# Altium schematic sheet [11] - CPU - POWER.SchDoc
size A2; DocumentNumber: 11; SheetNumber: 11; SheetTotal: 20
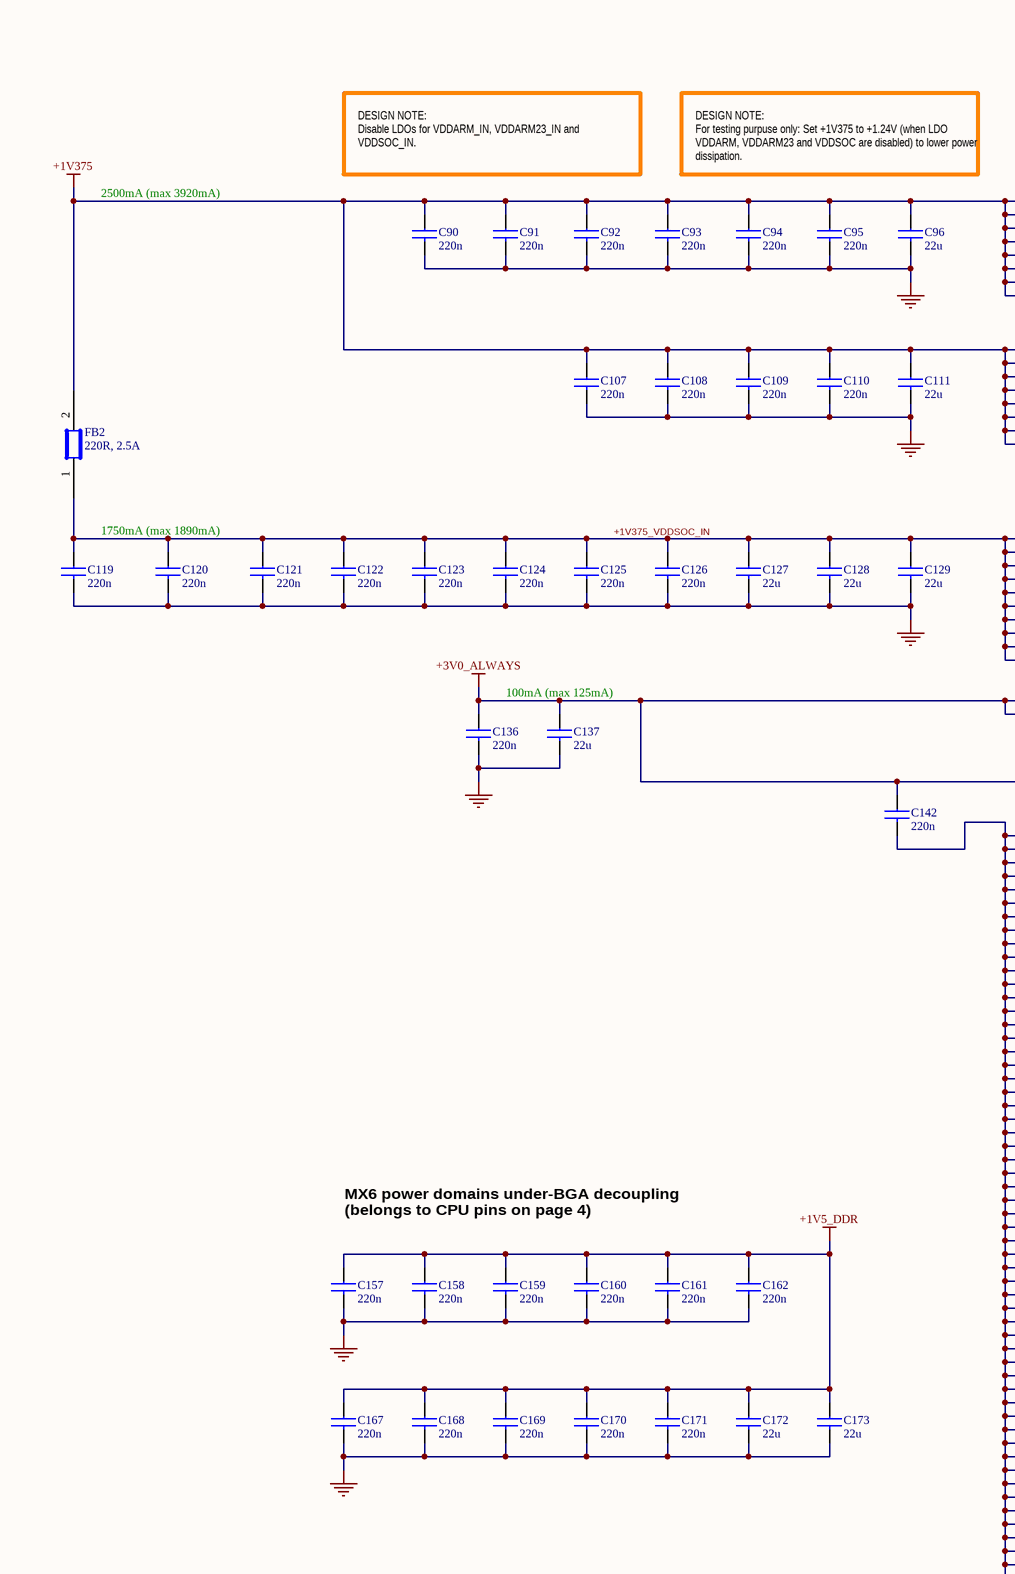
[diagram p0: [11] - CPU - POWER.SchDoc, left]
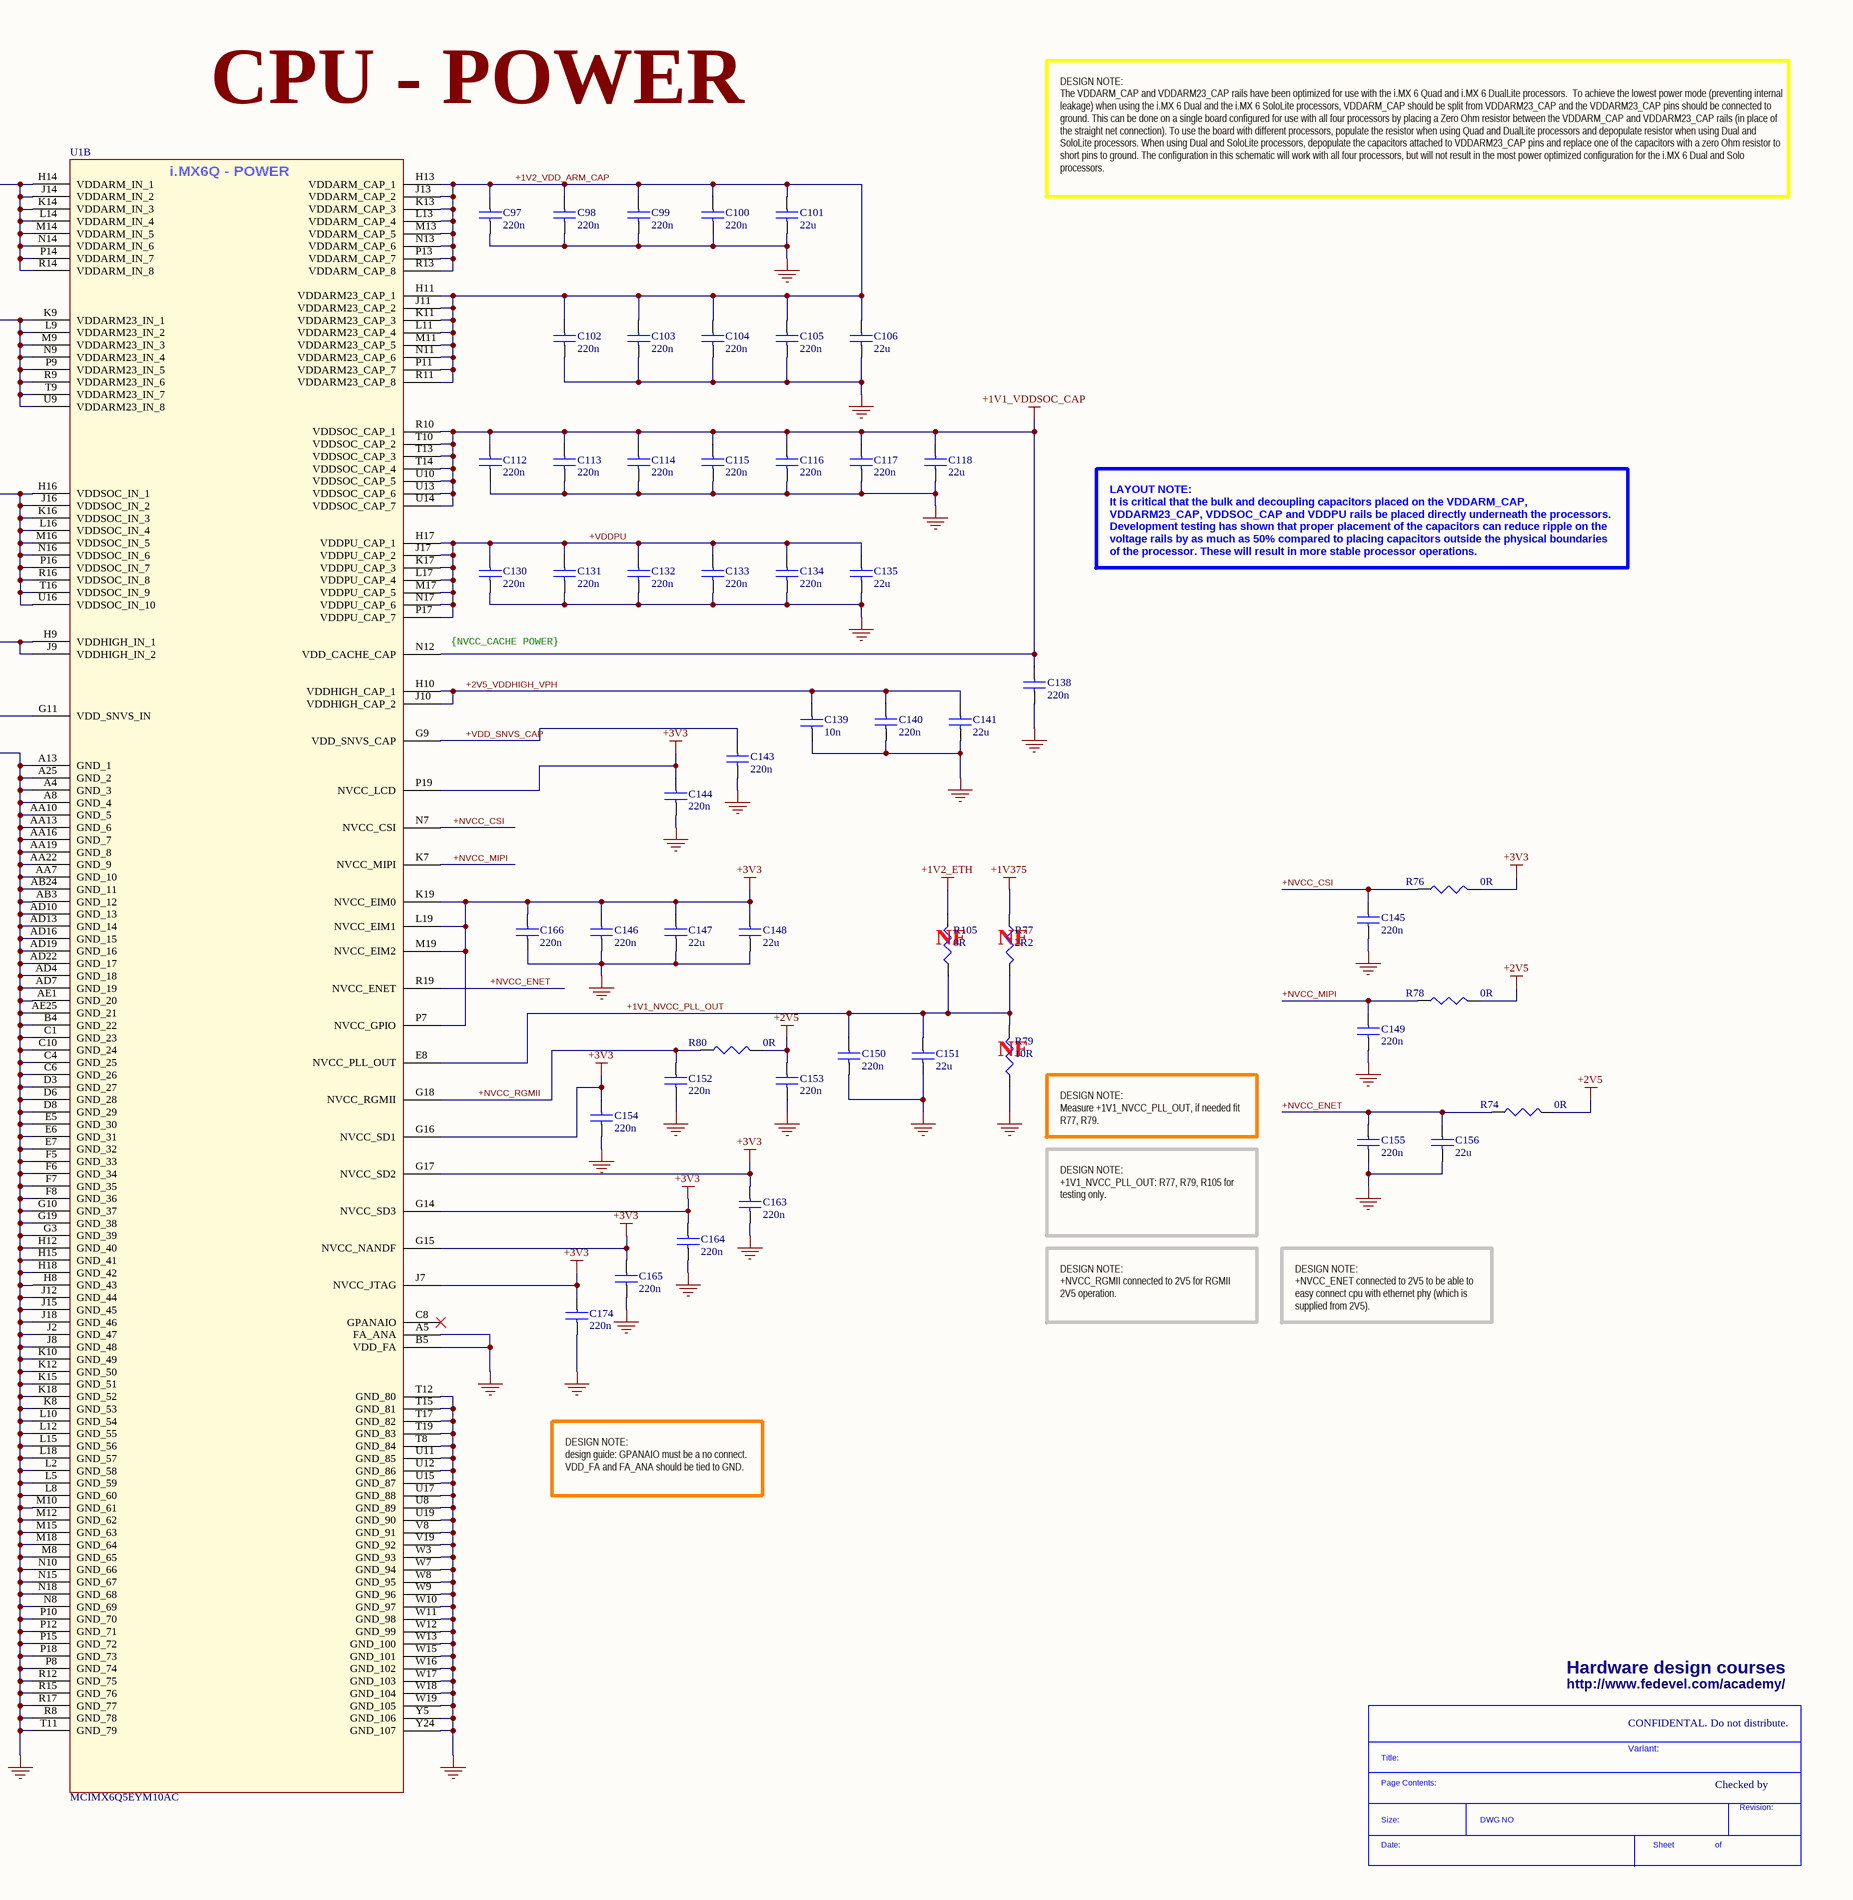
[diagram p1: [11] - CPU - POWER.SchDoc, right]

## Parts
*  SDTitleBlock  (value not drawn)  (graphical)
C90  220n  [C0402]
C91  220n  [C0402]
C92  220n  [C0402]
C93  220n  [C0402]
C94  220n  [C0402]
C95  220n  [C0402]
C96  22u  [C0603]
C97  220n  [C0402]
C98  220n  [C0402]
C99  220n  [C0402]
C100  220n  [C0402]
C101  22u  [C0603]
C102  220n  [C0402]
C103  220n  [C0402]
C104  220n  [C0402]
C105  220n  [C0402]
C106  22u  [C0603]
C107  220n  [C0402]
C108  220n  [C0402]
C109  220n  [C0402]
C110  220n  [C0402]
C111  22u  [C0603]
C112  220n  [C0402]
C113  220n  [C0402]
C114  220n  [C0402]
C115  220n  [C0402]
C116  220n  [C0402]
C117  220n  [C0402]
C118  22u  [C0603]
C119  220n  [C0402]
C120  220n  [C0402]
C121  220n  [C0402]
C122  220n  [C0402]
C123  220n  [C0402]
C124  220n  [C0402]
C125  220n  [C0402]
C126  220n  [C0402]
C127  22u  [C0603]
C128  22u  [C0603]
C129  22u  [C0603]
C130  220n  [C0402]
C131  220n  [C0402]
C132  220n  [C0402]
C133  220n  [C0402]
C134  220n  [C0402]
C135  22u  [C0603]
C136  220n  [C0402]
C137  22u  [C0805]
C138  220n  [C0402]
C139  10n  [C0402]
C140  220n  [C0402]
C141  22u  [C0805]
C142  220n  [C0402]
C143  220n  [C0402]
C144  220n  [C0402]
C145  220n  [C0402]
C146  220n  [C0402]
C147  22u  [C0805]
C148  22u  [C0805]
C149  220n  [C0402]
C150  220n  [C0402]
C151  22u  [C0603]
C152  220n  [C0402]
C153  220n  [C0402]
C154  220n  [C0402]
C155  220n  [C0402]
C156  22u  [C0805]
C157  220n  [C0402]
C158  220n  [C0402]
C159  220n  [C0402]
C160  220n  [C0402]
C161  220n  [C0402]
C162  220n  [C0402]
C163  220n  [C0402]
C164  220n  [C0402]
C165  220n  [C0402]
C166  220n  [C0402]
C167  220n  [C0402]
C168  220n  [C0402]
C169  220n  [C0402]
C170  220n  [C0402]
C171  220n  [C0402]
C172  22u  [C0603]
C173  22u  [C0603]
C174  220n  [C0402]
FB2  220R, 2.5A  [C0603]
R74  0R  [R0402]
R76  0R  [R0402]
R77  2R2  [R0402]
R78  0R  [R0402]
R79  10R  [R0402]
R80  0R  [R0402]
R105  0R  [R0402]
U1  MCIMX6Q5EYM10AC  [PBGA624]  (part B of 15)

## Nets
+1V1_VDDSOC_CAP: C112.1 C113.1 C114.1 C115.1 C116.1 C117.1 C118.1 C138.1 U1.N12(VDD_CACHE_CAP) U1.R10(VDDSOC_CAP_1) U1.T10(VDDSOC_CAP_2) U1.T13(VDDSOC_CAP_3) U1.T14(VDDSOC_CAP_4) U1.U10(VDDSOC_CAP_5) U1.U13(VDDSOC_CAP_6) U1.U14(VDDSOC_CAP_7)
+1V2_ETH: R105.2
+1V5_DDR: C157.1 C158.1 C159.1 C160.1 C161.1 C162.1 C167.1 C168.1 C169.1 C170.1 C171.1 C172.1 C173.1
+1V375: C90.1 C91.1 C92.1 C93.1 C94.1 C95.1 C96.1 C107.1 C108.1 C109.1 C110.1 C111.1 FB2.2 R77.1 U1.H14(VDDARM_IN_1) U1.J14(VDDARM_IN_2) U1.K9(VDDARM23_IN_1) U1.K14(VDDARM_IN_3) U1.L9(VDDARM23_IN_2) U1.L14(VDDARM_IN_4) U1.M9(VDDARM23_IN_3) U1.M14(VDDARM_IN_5) U1.N9(VDDARM23_IN_4) U1.N14(VDDARM_IN_6) U1.P9(VDDARM23_IN_5) U1.P14(VDDARM_IN_7) U1.R9(VDDARM23_IN_6) U1.R14(VDDARM_IN_8) U1.T9(VDDARM23_IN_7) U1.U9(VDDARM23_IN_8)
+2V5: C153.1 R74.2 R78.2 R80.2
+3V0_ALWAYS: C136.1 C137.1 C142.1 U1.G11(VDD_SNVS_IN) U1.H9(VDDHIGH_IN_1) U1.J9(VDDHIGH_IN_2)
+3V3: C144.1 C146.1 C147.1 C148.1 C154.1 C163.1 C164.1 C165.1 C166.1 C174.1 R76.2 U1.G14(NVCC_SD3) U1.G15(NVCC_NANDF) U1.G16(NVCC_SD1) U1.G17(NVCC_SD2) U1.J7(NVCC_JTAG) U1.K19(NVCC_EIM0) U1.L19(NVCC_EIM1) U1.M19(NVCC_EIM2) U1.P7(NVCC_GPIO) U1.P19(NVCC_LCD)
GND: C90.2 C91.2 C92.2 C93.2 C94.2 C95.2 C96.2 C97.2 C98.2 C99.2 C100.2 C101.2 C102.2 C103.2 C104.2 C105.2 C106.2 C107.2 C108.2 C109.2 C110.2 C111.2 C112.2 C113.2 C114.2 C115.2 C116.2 C117.2 C118.2 C119.2 C120.2 C121.2 C122.2 C123.2 C124.2 C125.2 C126.2 C127.2 C128.2 C129.2 C130.2 C131.2 C132.2 C133.2 C134.2 C135.2 C136.2 C137.2 C138.2 C139.1 C140.2 C141.2 C142.2 C143.2 C144.2 C145.2 C146.2 C147.2 C148.2 C149.2 C150.2 C151.2 C152.2 C153.2 C154.2 C155.2 C156.2 C157.2 C158.2 C159.2 C160.2 C161.2 C162.2 C163.2 C164.2 C165.2 C166.2 C167.2 C168.2 C169.2 C170.2 C171.2 C172.2 C173.2 C174.2 R79.1 U1.A4(GND_3) U1.A5(FA_ANA) U1.A8(GND_4) U1.A13(GND_1) U1.A25(GND_2) U1.AA7(GND_10) U1.AA10(GND_5) U1.AA13(GND_6) U1.AA16(GND_7) U1.AA19(GND_8) U1.AA22(GND_9) U1.AB3(GND_12) U1.AB24(GND_11) U1.AD4(GND_18) U1.AD7(GND_19) U1.AD10(GND_13) U1.AD13(GND_14) U1.AD16(GND_15) U1.AD19(GND_16) U1.AD22(GND_17) U1.AE1(GND_20) U1.AE25(GND_21) U1.B4(GND_22) U1.B5(VDD_FA) U1.C1(GND_23) U1.C4(GND_25) U1.C6(GND_26) U1.C10(GND_24) U1.D3(GND_27) U1.D6(GND_28) U1.D8(GND_29) U1.E5(GND_30) U1.E6(GND_31) U1.E7(GND_32) U1.F5(GND_33) U1.F6(GND_34) U1.F7(GND_35) U1.F8(GND_36) U1.G3(GND_39) U1.G10(GND_37) U1.G19(GND_38) U1.H8(GND_43) U1.H12(GND_40) U1.H15(GND_41) U1.H18(GND_42) U1.J2(GND_47) U1.J8(GND_48) U1.J12(GND_44) U1.J15(GND_45) U1.J18(GND_46) U1.K8(GND_53) U1.K10(GND_49) U1.K12(GND_50) U1.K15(GND_51) U1.K18(GND_52) U1.L2(GND_58) U1.L5(GND_59) U1.L8(GND_60) U1.L10(GND_54) U1.L12(GND_55) U1.L15(GND_56) U1.L18(GND_57) U1.M8(GND_65) U1.M10(GND_61) U1.M12(GND_62) U1.M15(GND_63) U1.M18(GND_64) U1.N8(GND_69) U1.N10(GND_66) U1.N15(GND_67) U1.N18(GND_68) U1.P8(GND_74) U1.P10(GND_70) U1.P12(GND_71) U1.P15(GND_72) U1.P18(GND_73) U1.R8(GND_78) U1.R12(GND_75) U1.R15(GND_76) U1.R17(GND_77) U1.T8(GND_84) U1.T11(GND_79) U1.T12(GND_80) U1.T15(GND_81) U1.T17(GND_82) U1.T19(GND_83) U1.U8(GND_89) U1.U11(GND_85) U1.U12(GND_86) U1.U15(GND_87) U1.U17(GND_88) U1.U19(GND_90) U1.V8(GND_91) U1.V19(GND_92) U1.W3(GND_93) U1.W7(GND_94) U1.W8(GND_95) U1.W9(GND_96) U1.W10(GND_97) U1.W11(GND_98) U1.W12(GND_99) U1.W13(GND_100) U1.W15(GND_101) U1.W16(GND_102) U1.W17(GND_103) U1.W18(GND_104) U1.W19(GND_105) U1.Y5(GND_106) U1.Y24(GND_107)
+1V1_NVCC_PLL_OUT: C150.1 C151.1 R77.2 R79.2 R105.1 U1.E8(NVCC_PLL_OUT)
+1V2_VDD_ARM_CAP: C97.1 C98.1 C99.1 C100.1 C101.1 C102.1 C103.1 C104.1 C105.1 C106.1 U1.H11(VDDARM23_CAP_1) U1.H13(VDDARM_CAP_1) U1.J11(VDDARM23_CAP_2) U1.J13(VDDARM_CAP_2) U1.K11(VDDARM23_CAP_3) U1.K13(VDDARM_CAP_3) U1.L11(VDDARM23_CAP_4) U1.L13(VDDARM_CAP_4) U1.M11(VDDARM23_CAP_5) U1.M13(VDDARM_CAP_5) U1.N11(VDDARM23_CAP_6) U1.N13(VDDARM_CAP_6) U1.P11(VDDARM23_CAP_7) U1.P13(VDDARM_CAP_7) U1.R11(VDDARM23_CAP_8) U1.R13(VDDARM_CAP_8)
+1V375_VDDSOC_IN: C119.1 C120.1 C121.1 C122.1 C123.1 C124.1 C125.1 C126.1 C127.1 C128.1 C129.1 FB2.1 U1.H16(VDDSOC_IN_1) U1.J16(VDDSOC_IN_2) U1.K16(VDDSOC_IN_3) U1.L16(VDDSOC_IN_4) U1.M16(VDDSOC_IN_5) U1.N16(VDDSOC_IN_6) U1.P16(VDDSOC_IN_7) U1.R16(VDDSOC_IN_8) U1.T16(VDDSOC_IN_9) U1.U16(VDDSOC_IN_10)
+2V5_VDDHIGH_VPH: C139.2 C140.1 C141.1 U1.H10(VDDHIGH_CAP_1) U1.J10(VDDHIGH_CAP_2)
+NVCC_CSI: C145.1 R76.1 U1.N7(NVCC_CSI)
+NVCC_ENET: C155.1 C156.1 R74.1 U1.R19(NVCC_ENET)
+NVCC_MIPI: C149.1 R78.1 U1.K7(NVCC_MIPI)
+NVCC_RGMII: C152.1 R80.1 U1.G18(NVCC_RGMII)
+VDD_SNVS_CAP: C143.1 U1.G9(VDD_SNVS_CAP)
+VDDPU: C130.1 C131.1 C132.1 C133.1 C134.1 C135.1 U1.H17(VDDPU_CAP_1) U1.J17(VDDPU_CAP_2) U1.K17(VDDPU_CAP_3) U1.L17(VDDPU_CAP_4) U1.M17(VDDPU_CAP_5) U1.N17(VDDPU_CAP_6) U1.P17(VDDPU_CAP_7)

Not connected (* = marked no-connect by the designer): U1 C8(GPANAIO)*

## Notes on the sheet
- CPU - POWER
- 2500mA (max 3920mA)
- DESIGN NOTE:
  Disable LDOs for VDDARM_IN, VDDARM23_IN and VDDSOC_IN.
- DESIGN NOTE:
  For testing purpuse only: Set +1V375 to +1.24V (when LDO VDDARM, VDDARM23 and VDDSOC are disabled) to lower power dissipation.
- DESIGN NOTE:
  The VDDARM_CAP and VDDARM23_CAP rails have been optimized for use with the i.MX 6 Quad and i.MX 6 DualLite processors.  To achieve the lowest power mode (preventing internal leakage) when using the i.MX 6 Dual and the i.MX 6 SoloLite processors, VDDARM_CAP should be split from VDDARM23_CAP and the VDDARM23_CAP pins should be connected to ground. This can be done on a single board configured for use with all four processors by placing a Zero Ohm resistor between the VDDARM_CAP and VDDARM23_CAP rails (in place of the straight net connection). To use the board with different processors, populate the resistor when using Quad and DualLite processors and depopulate resistor when using Dual and SoloLite processors. When using Dual and SoloLite processors, depopulate the capacitors attached to VDDARM23_CAP pins and replace one of the capacitors with a zero Ohm resistor to short pins to ground. The configuration in this schematic will work with all four processors, but will not result in the most power optimized configuration for the i.MX 6 Dual and Solo processors.
- 1750mA (max 1890mA)
- LAYOUT NOTE:
  It is critical that the bulk and decoupling capacitors placed on the VDDARM_CAP, VDDARM23_CAP, VDDSOC_CAP and VDDPU rails be placed directly underneath the processors. Development testing has shown that proper placement of the capacitors can reduce ripple on the voltage rails by as much as 50% compared to placing capacitors outside the physical boundaries of the processor. These will result in more stable processor operations.
- 100mA (max 125mA)
- {NVCC_CACHE POWER}
- (near R105) NF
- (near R77) NF
- (near R79) NF
- MX6 power domains under-BGA decoupling (belongs to CPU pins on page 4)
- DESIGN NOTE:
  Measure +1V1_NVCC_PLL_OUT, if needed fit R77, R79.
- DESIGN NOTE:
  +1V1_NVCC_PLL_OUT: R77, R79, R105 for testing only.
- DESIGN NOTE:
  +NVCC_RGMII connected to 2V5 for RGMII 2V5 operation.
- DESIGN NOTE:
  +NVCC_ENET connected to 2V5 to be able to easy connect cpu with ethernet phy (which is supplied from 2V5).
- DESIGN NOTE:
  design guide: GPANAIO must be a no connect. VDD_FA and FA_ANA should be tied to GND.
- Hardware design courses
- http://www.fedevel.com/academy/
- CONFIDENTAL. Do not distribute.
- Variant:
- Checked by
- (in symbol MCIMX6Q5EYM10AC, part B) i.MX6Q - POWER
- (in symbol SDTitleBlock) Title:; Page Contents:; Revision:; Size:; DWG NO; Date:; Sheet; of

## Library data of the parts
C90-C95 C97-C100 C102-C105 C107-C110 C112-C117 C119-C126 C130-C134 C136 C138 C140 C142-C146 C149 C150 C152-C155 C157-C171 C174 = C1005X5R1E224M: CAP CER .22UF 25V X5R 20% 0402; Manufacturer: TDK Corporation; Capacitance: 0.22µF; Value: 220nF; .Checked PCB: used; Description: CAP CER 0.22UF 25V 20% X5R 0402; Category: Capacitors; Supplier Part Number: 445-5945-1-ND; Manufacturer Part Number: C1005X5R1E224M; Operating Temperature: -55°C ~ 85°C; Package / Case: 0402 (1005 Metric); Price 1k [$]: 0.02600; .Checked SCH: used; Voltage - Rated: 25V; Supplier: Digikey; Supplier 1: Digi-Key; Supplier Part Number 1: 445-5945-1-ND; RoHS: RoHS Compliant; Stock 1: 54593; Pricing 1: 1=0.3, 10=0.2, 100=0.08, 250=0.05752, 500=0.041, 1000=0.03 (USD); Tolerance: ±20%; Temperature Coefficient: X5R; Mounting Type: Surface Mount, MLCC; Applications: General Purpose; Ratings: -; Size / Dimension: 0.039" L x 0.020" W (1.00mm x 0.50mm); Height - Seated (Max): -; Thickness (Max): 0.022" (0.55mm); Lead Spacing: -; Features: -; Packaging: Cut Tape (CT); Lead Style: -; ComponentLink1URL: http://www.tdk.co.jp/tefe02/e412_c.pdf; ComponentLink1Description: http://www.tdk.co.jp/tefe02/e412_c.pdf
C96 C101 C106 C111 C118 C127-C129 C135 C151 C172 C173 = GRM188R60G226MEA0L: CAP CER 22UF 4V 20% X5R 0603; Manufacturer: Murata Electronics North America; Capacitance: 22µF; .Checked PCB: RF, used by MM; .Checked SCH: MM, checked by RF; .Creator: MM; Supplier 1: Digi-Key; Supplier Part Number 1: 490-5526-1-ND; Manufacturer Part Number: GRM188R60G226MEA0L; RoHS: RoHS Compliant; Category: Capacitors; Stock 1: 5760; Pricing 1: 1=0.79, 10=0.663, 50=0.4752, 100=0.4158, 250=0.32672, 500=0.297, 1000=0.2376 (USD); Voltage - Rated: 4V; Tolerance: ±20%; Temperature Coefficient: X5R; Mounting Type: Surface Mount, MLCC; Operating Temperature: -55°C ~ 85°C; Applications: General Purpose; Ratings: -; Package / Case: 0603 (1608 Metric); Size / Dimension: 0.063" L x 0.031" W (1.60mm x 0.80mm); Height - Seated (Max): -; Thickness (Max): 0.035" (0.90mm); Lead Spacing: -; Features: -; Packaging: Cut Tape (CT); Lead Style: -; ComponentLink1URL: http://www.murata.com/products/catalog/pdf/c02e.pdf; ComponentLink1Description: http://www.murata.com/products/catalog/pdf/c02e.pdf
C137 C141 C147 C148 C156 = C2012X5R1C226K: CAP CER 22UF 16V 10% X5R 0805; Manufacturer: TDK Corporation; Capacitance: 22µF; .Checked PCB: RF; Supplier 1: Digi-Key; Supplier Part Number 1: 445-6797-1-ND; Manufacturer Part Number: C2012X5R1C226K; RoHS: RoHS Compliant; Category: Capacitors; Stock 1: 15408; Pricing 1: 1=0.77, 10=0.737, 100=0.3575, 250=0.297, 500=0.2695, 1000=0.2475 (USD); Voltage - Rated: 16V; Tolerance: ±10%; Temperature Coefficient: X5R; Mounting Type: Surface Mount, MLCC; Operating Temperature: -55°C ~ 85°C; Applications: General Purpose; Ratings: -; Package / Case: 0805 (2012 Metric); Size / Dimension: 0.079" L x 0.049" W (2.00mm x 1.25mm); Height - Seated (Max): -; Thickness (Max): 0.057" (1.45mm); Lead Spacing: -; Features: -; Packaging: Cut Tape (CT); Lead Style: -; ComponentLink1URL: http://www.tdk.com/pdf/general_B11.pdf; ComponentLink1Description: http://www.tdk.com/pdf/general_B11.pdf; .Checked SCH: RF
C139 = C1005X7R1H103K: CAP CER 10000PF 50V 10% X7R 0402; Manufacturer: TDK Corporation; Value: 10nF; .Checked PCB: RF; Capacitance: 10000pF; Category: Capacitors; Supplier Part Number: 445-6850-1-ND; Manufacturer Part Number: C1005X7R1H103K; Operating Temperature: -55°C ~ 125°C; Package / Case: 0402 (1005 Metric); Price 1k [$]: 0.01625; .Checked SCH: RF; Voltage - Rated: 50V; Supplier: Digikey; Supplier 1: Digi-Key; Supplier Part Number 1: 445-6850-1-ND; RoHS: RoHS Compliant; Stock 1: 3901; Pricing 1: 1=0.2, 10=0.125, 100=0.045, 250=0.03252, 500=0.024, 1000=0.01625 (USD); Tolerance: ±10%; Temperature Coefficient: X7R; Mounting Type: Surface Mount, MLCC; Applications: General Purpose; Ratings: -; Size / Dimension: 0.039" L x 0.020" W (1.00mm x 0.50mm); Height - Seated (Max): -; Thickness (Max): 0.022" (0.55mm); Lead Spacing: -; Features: -; Packaging: Cut Tape (CT); Lead Style: -; ComponentLink1URL: http://www.tdk.co.jp/tefe02/e412_c.pdf; ComponentLink1Description: http://www.tdk.co.jp/tefe02/e412_c.pdf
FB2 = BLM18SG221TN1D: FERRITE CHIP 220 OHM 2500MA 0603; Manufacturer: Murata Electronics North America; Impedance @ Frequency: 220 Ohm @ 100MHz; DC Resistance (DCR): 40 mOhm Max; Filter Type: Differential Mode - Single; Number of Lines: 1; .Checked PCB: RF; Supplier 1: Digi-Key; Supplier Part Number 1: 490-5225-1-ND; Manufacturer Part Number: BLM18SG221TN1D; RoHS: RoHS Compliant; Category: Filters; Stock 1: 54640; Pricing 1: 1=0.38, 10=0.282, 50=0.1646, 100=0.1316, 250=0.094, 500=0.06392, 1000=0.0517, 5000=0.04042 (USD); Current Rating: 2.5A; Package / Case: 0603 (1608 Metric); Mounting Type: Surface Mount; Packaging: Cut Tape (CT); Height (Max): 0.037" (0.95mm); Size / Dimension: 0.063" L x 0.031" W (1.60mm x 0.80mm); ComponentLink1URL: http://search.murata.co.jp/Ceramy/image/img/PDF/ENG/L0110S0100BLM18S.pdf; ComponentLink1Description: http://search.murata.co.jp/Ceramy/image/img/PDF/ENG/L0110S0100BLM18S.pdf; .Checked SCH: RF
R74 R76 R78 R80 R105 = RC0402JR-070RL: RES 0.0 OHM 1/16W 0402 SMD; Manufacturer: Yageo; Resistance (Ohms): 0.0; Power (Watts): 0.063W, 1/16W; Tolerance: Jumper; .Checked PCB: used; Category: Resistors; Supplier Part Number: 311-0.0JRCT-ND; Manufacturer Part Number: RC0402JR-070RL; Package / Case: 0402 (1005 Metric); Price 1k [$]: 0.01389; Value: 0R; .Checked SCH: used; Supplier: Digikey; Supplier 1: Digi-Key; Supplier Part Number 1: 311-0.0JRCT-ND; RoHS: RoHS Compliant; Stock 1: 1106330; Pricing 1: 10=0.012, 50=0.009, 100=0.0069, 250=0.00512, 500=0.0038, 1000=0.00253 (USD); Composition: Thick Film; Features: -; Temperature Coefficient: -; Size / Dimension: 0.039" L x 0.020" W (1.00mm x 0.50mm); Height: 0.016" (0.40mm); Number of Terminations: 2; Packaging: Cut Tape (CT); ComponentLink1URL: http://www.yageo.com/documents/recent/PYu-RC0402_51_RoHS_L_6.pdf; ComponentLink1Description: http://www.yageo.com/documents/recent/PYu-RC0402_51_RoHS_L_6.pdf
R77 = CRCW04022R20FKED: RES 2.20 OHM 1/16W 1% 0402 SMD; Manufacturer: Vishay Dale; Resistance (Ohms): 2.2; Power (Watts): 0.063W, 1/16W; Temperature Coefficient: ±100ppm/°C; .Checked PCB: RF; Supplier 1: Digi-Key; Supplier Part Number 1: 541-2.20LLCT-ND; Manufacturer Part Number: CRCW04022R20FKED; RoHS: RoHS Compliant; Category: Resistors; Stock 1: 10205; Pricing 1: 10=0.083, 50=0.0444, 200=0.0255, 1000=0.0174 (USD); Composition: Thick Film; Features: -; Tolerance: ±1%; Package / Case: 0402 (1005 Metric); Size / Dimension: 0.039" L x 0.020" W (1.00mm x 0.50mm); Height: 0.016" (0.40mm); Number of Terminations: 2; Packaging: Cut Tape (CT); ComponentLink1URL: http://www.vishay.com/docs/20035/dcrcwe3.pdf; ComponentLink1Description: http://www.vishay.com/docs/20035/dcrcwe3.pdf; .Checked SCH: RF
R79 = RC0402FR-0710RL: RES 10.0 OHM 1/16W 1% 0402 SMD; Manufacturer: Yageo; Resistance (Ohms): 10; Power (Watts): 0.063W, 1/16W; .Checked PCB: used; Temperature Coefficient: ±200ppm/°C; Category: Resistors; Supplier Part Number: 311-10.0LRCT-ND; Manufacturer Part Number: RC0402FR-0710RL; Package / Case: 0402 (1005 Metric); Price 1k [$]: 0.01421; Tolerance: ±1%; Value: 10R; .Checked SCH: used; Supplier: Digikey; Supplier 1: Digi-Key; Supplier Part Number 1: 311-10.0LRCT-ND; RoHS: RoHS Compliant; Stock 1: 681416; Pricing 1: 10=0.014, 50=0.0104, 100=0.0079, 250=0.00584, 500=0.00432, 1000=0.00288 (USD); Composition: Thick Film; Features: -; Size / Dimension: 0.039" L x 0.020" W (1.00mm x 0.50mm); Height: 0.016" (0.40mm); Number of Terminations: 2; Packaging: Cut Tape (CT); ComponentLink1URL: http://www.yageo.com/documents/recent/PYu-RC0402_51_RoHS_L_6.pdf; ComponentLink1Description: http://www.yageo.com/documents/recent/PYu-RC0402_51_RoHS_L_6.pdf
U1 = MCIMX6Q5EYM10AC: IC MCU 32BIT ARM QUAD 624FCBGA; Manufacturer: Freescale Semiconductor; Core Processor: ARM® Cortex™-A9; Core Size: 32-Bit Quad-Core; Speed: 1.0GHz; Connectivity: CAN, EBI/EMI, ESAI, Ethernet, GPMI, I2C, MMC/SD, PCI, SATA, SPI, UART, USB, USB OTG; Peripherals: DMA, HDMI, I2S/SSI/AC97, MIPI CSI, MIMI DSI, MIPI HIS, PWM, WDT; Number of I /O: 224; Program Memory Type: External Program Memory; RAM Size: 256K x 8; Voltage - Supply (Vcc/Vdd): 0.925 V ~ 1.5 V; Oscillator Type: Internal; .Creator: MM; .Checked PCB: MM, checked by RF; Supplier 1: Digi-Key; Manufacturer Part Number: MCIMX6Q5EYM10AC; RoHS: RoHS Compliant; Category: Integrated Circuits (ICs); Stock 1: 0; Pricing 1: 1=54.98, 10=51.922, 25=48.868, 100=30.5424 (USD); Program Memory Size: -; EEPROM Size: -; Data Converters: -; Operating Temperature: -20°C ~ 105°C; Package / Case: 624-FBGA, FCBGA; Packaging: Tray; ComponentLink1URL: http://cache.freescale.com/files/32bit/doc/data_sheet/IMX6DQCEC.pdf; ComponentLink1Description: http://cache.freescale.com/files/32bit/doc/data_sheet/IMX6DQCEC.pdf; Supplier Part Number 1: MCIMX6Q5EYM10AC-ND; .Checked SCH: MM